# EAGLE design PDMschemE-Car2018 (EAGLE 8.4.1)
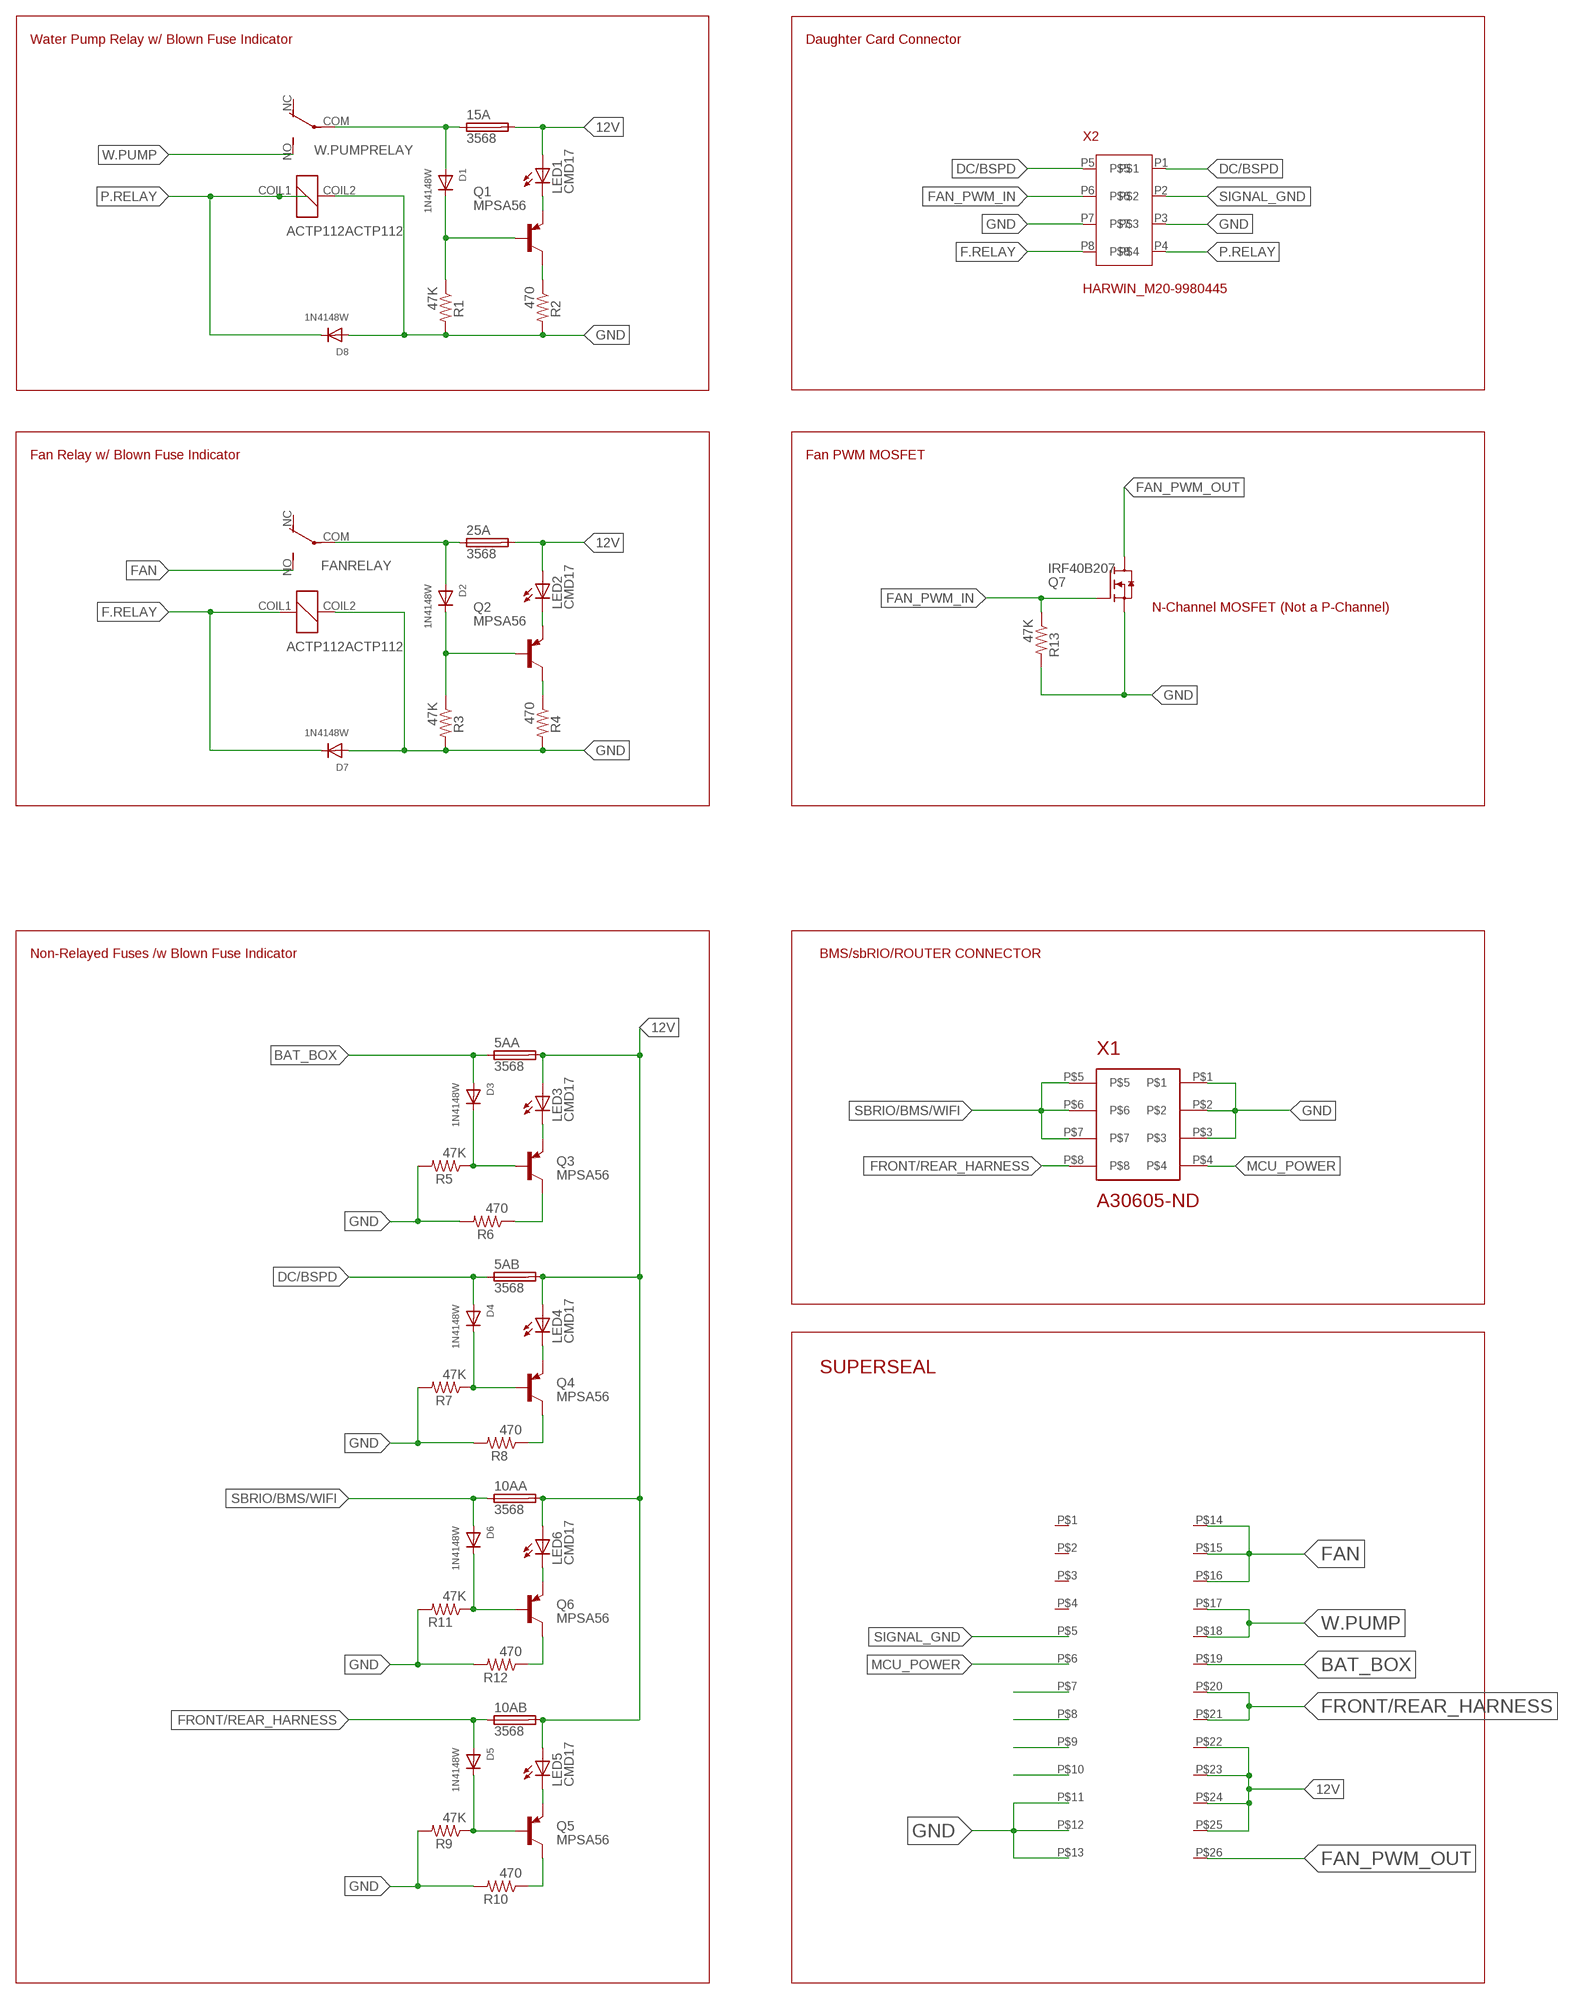
[diagram p0: schematic, sheet 1]

## Parts
5AA  3568  [3568]
5AB  3568  [3568]
10AA  3568  [3568]
10AB  3568  [3568]
15A  3568  [3568]
25A  3568  [3568]
D1  1N4148W  DIODESOD-123  [SOD-123]
D2  1N4148W  DIODESOD-123  [SOD-123]
D3  1N4148W  DIODESOD-123  [SOD-123]
D4  1N4148W  DIODESOD-123  [SOD-123]
D5  1N4148W  DIODESOD-123  [SOD-123]
D6  1N4148W  DIODESOD-123  [SOD-123]
D7  1N4148W  DIODESOD-123  [SOD-123]
D8  1N4148W  DIODESOD-123  [SOD-123]
FANRELAY  ACTP112ACTP112  [ACTP112]
LED1  CMD17  LEDCHIPLED_0805  [CHIPLED_0805]
LED2  CMD17  LEDCHIPLED_0805  [CHIPLED_0805]
LED3  CMD17  LEDCHIPLED_0805  [CHIPLED_0805]
LED4  CMD17  LEDCHIPLED_0805  [CHIPLED_0805]
LED5  CMD17  LEDCHIPLED_0805  [CHIPLED_0805]
LED6  CMD17  LEDCHIPLED_0805  [CHIPLED_0805]
Q1  MPSA56  [TO92-CBE]
Q2  MPSA56  [TO92-CBE]
Q3  MPSA56  [TO92-CBE]
Q4  MPSA56  [TO92-CBE]
Q5  MPSA56  [TO92-CBE]
Q6  MPSA56  [TO92-CBE]
Q7  IRF40B207  [TO220-3]
R1  47K  R-US_R1206  [R1206]
R2  470  R-US_R1206  [R1206]
R3  47K  R-US_R1206  [R1206]
R4  470  R-US_R1206  [R1206]
R5  47K  R-US_R1206  [R1206]
R6  470  R-US_R1206  [R1206]
R7  47K  R-US_R1206  [R1206]
R8  470  R-US_R1206  [R1206]
R9  47K  R-US_R1206  [R1206]
R10  470  R-US_R1206  [R1206]
R11  47K  R-US_R1206  [R1206]
R12  470  R-US_R1206  [R1206]
R13  47K  R-US_R1206  [R1206]
U$4  SUPERSEAL1.0_26POS_2ROW  [SUPERSEAL1.0_26POS_2ROW]
W.PUMPRELAY  ACTP112ACTP112  [ACTP112]
X1  A30605-ND  [A30605-ND]
X2  HARWIN_M20-9980445  [HARWIN_M20-9980445]

## Nets
12V: 5AA.3 5AA.4 5AB.3 5AB.4 10AA.3 10AA.4 10AB.3 10AB.4 15A.3 15A.4 25A.3 25A.4 LED1.A LED2.A LED3.A LED4.A LED5.A LED6.A U$4.P$22(B22) U$4.P$23(B23) U$4.P$24(B24) U$4.P$25(B25)
BAT_BOX: 5AA.1 5AA.2 D3.A U$4.P$19(B19)
DC/BSPD: 5AB.1 5AB.2 D4.A X2.P1 X2.P5
F.RELAY: D7.C FANRELAY.COIL1 X2.P8
FAN: FANRELAY.NO U$4.P$14(B14) U$4.P$15(B15) U$4.P$16(B16)
FAN_PWM_IN: Q7.G R13.1 X2.P6
FAN_PWM_OUT: Q7.D U$4.P$26(B26)
FRONT/REAR_HARNESS: 10AB.1 10AB.2 D5.A U$4.P$20(B20) U$4.P$21(B21) X1.P$8
GND: D7.A D8.A FANRELAY.COIL2 Q7.S R1.2 R2.2 R3.2 R4.2 R5.2 R6.2 R7.2 R8.2 R9.2 R10.2 R11.2 R12.2 R13.2 U$4.P$11(B11) U$4.P$12(B12) U$4.P$13(B13) W.PUMPRELAY.COIL2 X1.P$1 X1.P$2 X1.P$3 X2.P3 X2.P7
MCU_POWER: U$4.P$6(B6) X1.P$4
N$1: LED1.C Q1.E
N$2: Q3.C R6.1
N$3: LED3.C Q3.E
N$4: 25A.1 25A.2 D2.A FANRELAY.COM
N$5: Q1.C R2.1
N$6: D1.C Q1.B R1.1
N$9: D2.C Q2.B R3.1
N$10: 15A.1 15A.2 D1.A W.PUMPRELAY.COM
N$11: Q2.C R4.1
N$13: LED2.C Q2.E
N$14: D3.C Q3.B R5.1
N$17: LED4.C Q4.E
N$18: D4.C Q4.B R7.1
N$19: Q4.C R8.1
N$22: LED6.C Q6.E
N$23: D6.C Q6.B R11.1
N$24: Q6.C R12.1
N$25: U$4.P$7(B7)
N$26: U$4.P$8(B8)
N$27: LED5.C Q5.E
N$28: D5.C Q5.B R9.1
N$29: Q5.C R10.1
N$30: U$4.P$9(B9)
N$31: U$4.P$10(B10)
P.RELAY: D8.C W.PUMPRELAY.COIL1 X2.P4
SBRIO/BMS/WIFI: 10AA.1 10AA.2 D6.A X1.P$5 X1.P$6 X1.P$7
SIGNAL_GND: U$4.P$5(B5) X2.P2
W.PUMP: U$4.P$17(B17) U$4.P$18(B18) W.PUMPRELAY.NO
Unconnected: FANRELAY.NC U$4.P$1(B1) U$4.P$2(B2) U$4.P$3(B3) U$4.P$4(B4) W.PUMPRELAY.NC

## Notes on the sheet
- Water Pump Relay w/ Blown Fuse Indicator | Daughter Card Connector
- Fan Relay w/ Blown Fuse Indicator | Fan PWM MOSFET
- N-Channel MOSFET (Not a P-Channel)
- Non-Relayed Fuses /w Blown Fuse Indicator | BMS/sbRIO/ROUTER CONNECTOR
- SUPERSEAL

## Library data of the parts
5AA 5AB 10AA 10AB 15A 25A = Keystone:3568: Mini ATC Fuse Holder 20A 500V 1 Circuit Blade PCB
D1-D8 = adafruit:DIODE: Diode SMADIODE - SMA Surface Mount Package 20V 1A Schottky Diode Digikey: 641-1014-6-ND DO-1N4148 - Through Hole Small Current Diode SOD-123 20V 1 A (.5mV Vf) Schottky Diode - Digikey: MBRX120TPMSCT-ND SOD-323 10V 570mA (.38mV Vf, 3ns) Schottky Diode - Digikey: ZLLS410CT-ND SOD-523 30V 30mA Schottky Diode (RB751S-40TE61) - Digikey: RB751S-40TE61CT-ND SOT23-R/W - SOT23 Package (R = Solder Paste/Reflow Ovens, W = Hand-Soldering) BAT54Film 40V 300mA - Digikey: 497-7162-1-ND
FANRELAY W.PUMPRELAY = panasonic:ACTP112: ACTP112 Through-Hole Micro Relay
LED1-LED6 = adafruit:LED: LED OSRAM: - CHIPLED LG R971, LG N971, LY N971, LG Q971, LY Q971, LO R971, LY R971 LH N974, LH R974 LS Q976, LO Q976, LY Q976 LO Q996 - Hyper CHIPLED LW Q18S LB Q993, LB Q99A, LB R99A - SideLED LS A670, LO A670, LY A670, LG A670, LP A670 LB A673, LV A673, LT A673, LW A673 LH A674 LY A675 LS A676, LA A676, LO A676, LY A676, LW A676 LS A679, LY A679, LG A679 - Hyper Micro SIDELED® LS Y876, LA Y876, LO Y876, LY Y876 LT Y87S - SmartLED LW L88C, LW L88S LB L89C, LB L89S, LG L890 LS L89K, LO L89K, LY L89K LS L896, LA L896, LO L896, LY L896 - TOPLED LS T670, LO T670, LY T670, LG T670, LP T670 LSG T670, LSP T670, LSY T670, LOP T670, LYG T670 LG T671, LOG T671, LSG T671 LB T673, LV T673, LT T673, LW T673 LH T674 LS T676, LA T676, LO T676, LY T676, LB T676, LH T676, LSB T676, LW T676 LB T67C, LV T67C, LT T67C, LS T67K, LO T67K, LY T67K, LW E67C LS E67B, LA E67B, LO E67B, LY E67B, LB E67C, LV E67C, LT E67C LW T67C LS T679, LY T679, LG T679 LS T770, LO T770, LY T770, LG T770, LP T770 LB T773, LV T773, LT T773, LW T773 LH T774 LS E675, LA E675, LY E675, LS T675 LS T776, LA T776, LO T776, LY T776, LB T776 LHGB T686 LT T68C, LB T68C - Hyper Mini TOPLED® LB M676 - Mini TOPLED Santana® LG M470 LS M47K, LO M47K, LY M47K Source: http://www.osram.convergy.de/
Q1-Q6 = transistor-pnp:MPSA56*: PNP Transistror Source: http://www.fairchildsemi.com/ds/MM/MMBTA56.pdf
Q7 = infineon:IRF40B207: N Channel Power Mosfet
R1-R13 = resistor:R-US_: RESISTOR, American symbol
U$4 = TE:SUPERSEAL1.0_26POS_2ROW
X1 = formula electric:A30605-ND
X2 = formula electric:HARWIN_M20-9980445

## Board
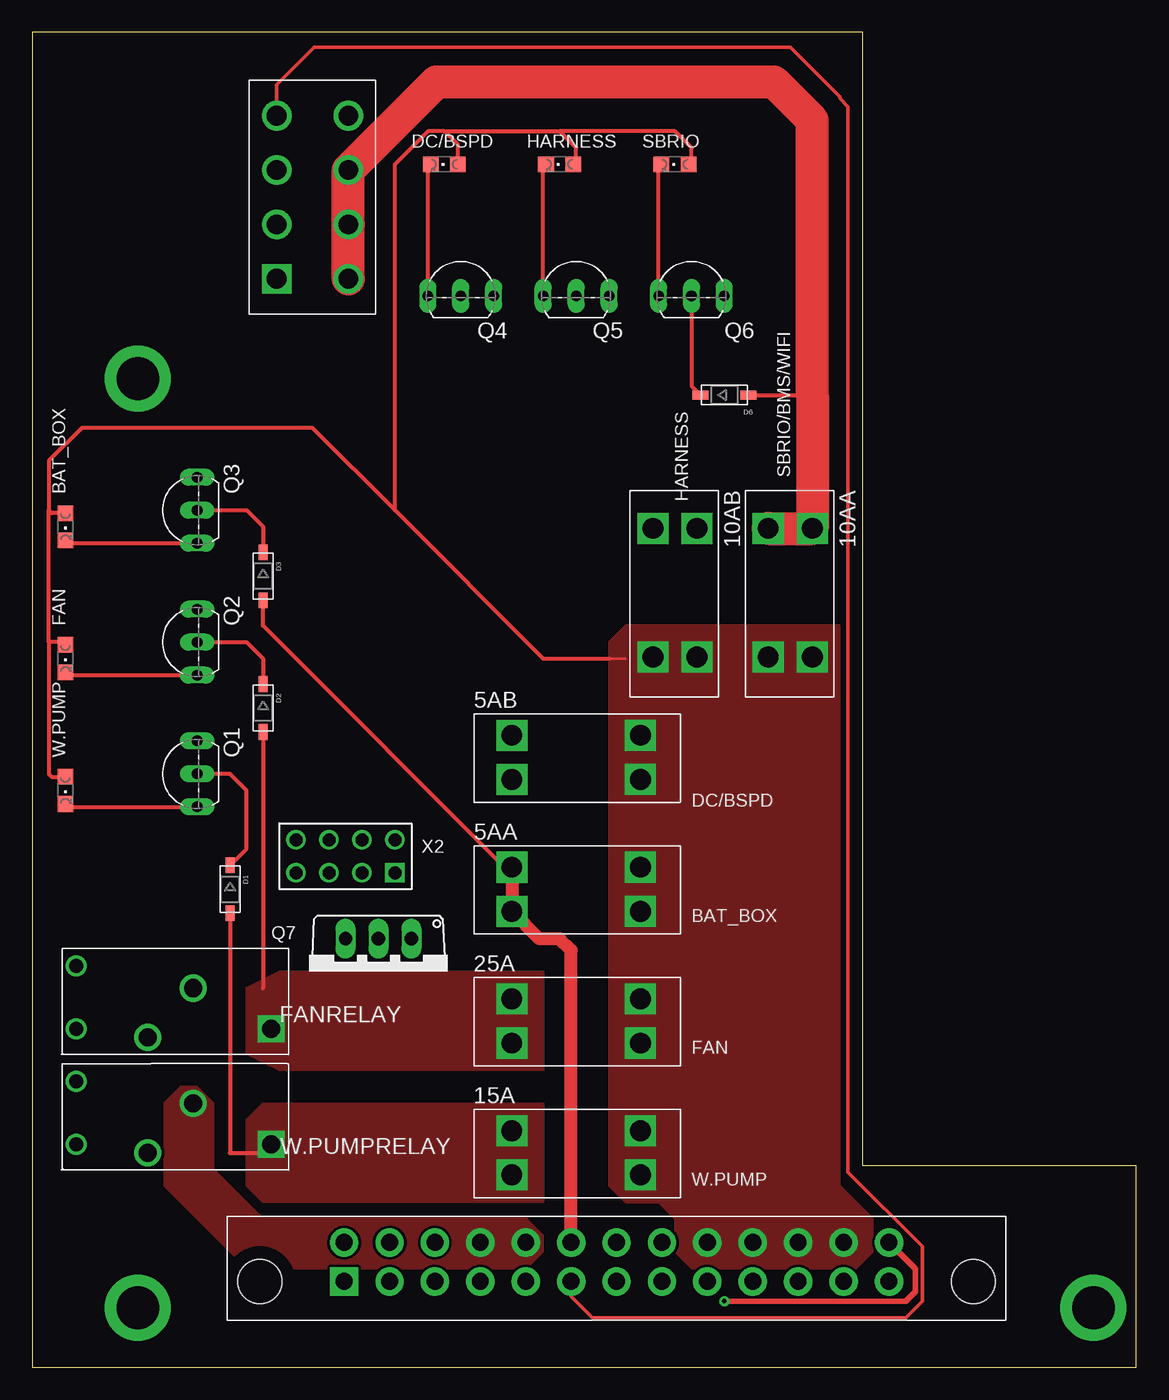
[diagram p1: board, top side]
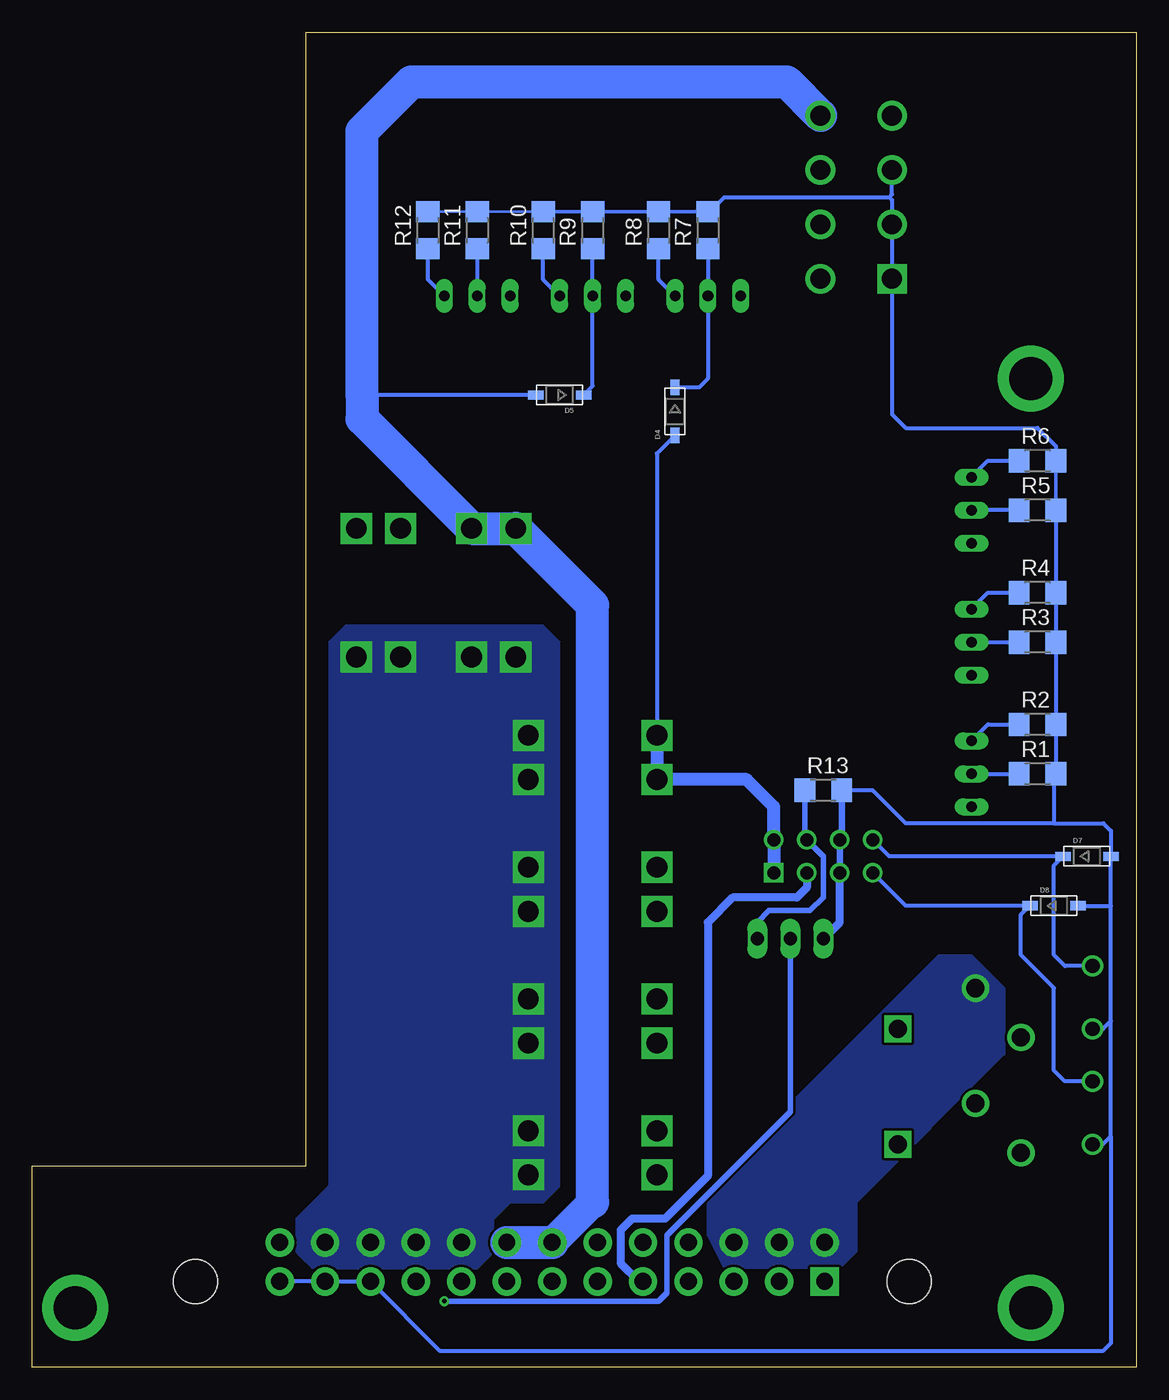
[diagram p2: board, bottom side, seen from below]

Size 85.09 x 102.87 mm. Coordinates in mm from the lower left corner, seen from the top.
Outline: 0,0 85.09,0 85.09,15.49 64.01,15.49 64.01,102.87 0,102.87 0,0
Copper layers (1*16): Top 0.035mm / dielectric 1.5mm / Bottom 0.035mm
Design rules "default *": minimum track width 6mil, minimum drill 0.35mm, track to track 8mil, track to pad 8mil, pad to pad 8mil, via to via 8mil, smd to smd 8mil, copper to edge 40mil, drill to drill 6mil, minimum pad ring 10mil, minimum via ring 8mil, stop-mask expansion 4mil, vias tented up to drill 0mil, thermal gap 10mil

### Footprints (pad centres in the part's own frame; a part is rotated, then mirrored left to right if it is on the bottom)
3568 = drill 1.6 square: 1 -4.953,1.702; 2 -4.953,-1.702; 3 4.953,1.702; 4 4.953,-1.702
SOD-123 = smd 1.2 x 0.7: A 1.85,0; C -1.85,0
ACTP112 = drill 1.092: COIL1 5.512,-5.512; COIL2 5.512,-0.66 | drill 1.397 square: COM -9.5,-0.66 | drill 1.397: NC 0,0; NO -3.505,-3.81
CHIPLED_0805 = smd 1.2 x 1.2: A 0,-1.05; C 0,1.05
TO92-CBE = drill 0.813 long: B 0,0; C 2.54,0; E -2.54,0
TO220-3 = drill 1.016 long: D 0,0; G -2.54,0; S 2.54,0
R1206 = smd 1.6 x 1.803: 1 -1.422,0; 2 1.422,0
SUPERSEAL1.0_26POS_2ROW = drill 1.3 pad 2.184 square: P$1 6.5,0 | drill 1.3 pad 2.184: P$2 10,0; P$3 13.5,0; P$4 17,0; P$5 20.5,0; P$6 24,0; P$7 27.5,0; P$8 31,0; P$9 34.5,0; P$10 38,0; P$11 41.5,0; P$12 45,0; P$13 48.5,0; P$14 6.5,3; P$15 10,3; P$16 13.5,3; P$17 17,3; P$18 20.5,3; P$19 24,3; P$20 27.5,3; P$21 31,3; P$22 34.5,3; P$23 38,3; P$24 41.5,3; P$25 45,3; P$26 48.5,3 | hole 3.4: 0,0; 55,0
A30605-ND = drill 1.524 square: P$1 -6.287,2.756 | drill 1.524: P$2 -2.095,2.756; P$3 2.095,2.756; P$4 6.287,2.756; P$5 -6.287,-2.756; P$6 -2.095,-2.756; P$7 2.095,-2.756; P$8 6.287,-2.756
HARWIN_M20-9980445 = drill 1 square: P1 -3.81,1.27 | drill 1: P2 -1.27,1.27; P3 1.27,1.27; P4 3.81,1.27; P5 -3.81,-1.27; P6 -1.27,-1.27; P7 1.27,-1.27; P8 3.81,-1.27

### Placement (x,y rotation side)
5AA  41.91,36.83 0 top
5AB  41.91,46.99 0 top
10AA  58.42,59.69 270 top
10AB  49.53,59.69 270 top
15A  41.91,16.51 0 top
25A  41.91,26.67 0 top
D1  15.24,36.83 270 top
D2  17.78,50.8 270 top
D3  17.78,60.96 270 top
D4  35.56,73.66 270 bottom
D5  44.45,74.93 180 bottom
D6  53.34,74.93 0 top
D7  3.81,39.37 0 bottom
D8  6.35,35.56 0 bottom
FANRELAY  8.89,25.4 180 top
LED1  2.54,44.45 180 top
LED2  2.54,54.61 180 top
LED3  2.54,64.77 180 top
LED4  31.75,92.71 90 top
LED5  40.64,92.71 90 top
LED6  49.53,92.71 90 top
Q1  12.7,45.72 90 top
Q2  12.7,55.88 90 top
Q3  12.7,66.04 90 top
Q4  33.02,82.55 0 top
Q5  41.91,82.55 0 top
Q6  50.8,82.55 0 top
Q7  26.67,33.02 180 top
R1  7.62,45.72 0 bottom
R2  7.62,49.53 0 bottom
R3  7.62,55.88 0 bottom
R4  7.62,59.69 0 bottom
R5  7.62,66.04 0 bottom
R6  7.62,69.85 0 bottom
R7  33.02,87.63 90 bottom
R8  36.83,87.63 90 bottom
R9  41.91,87.63 90 bottom
R10  45.72,87.63 90 bottom
R11  50.8,87.63 90 bottom
R12  54.61,87.63 90 bottom
R13  24.13,44.45 0 bottom
U$4  17.53,6.6 0 top
W.PUMPRELAY  8.89,16.51 180 top
X1  21.59,90.17 90 top
X2  24.13,39.37 180 top

### Tracks (layer width: path | path; a pad name or v marks a point on that pad's centre or on a via)
12V
  Top 0.152: 2.54,66.04 LED3.A | 32.91,92.82 LED4.A | 41.8,92.82 LED5.A | 50.69,92.82 LED6.A | 44.45,54.61 45.72,54.61
  Top 0.203: 2.32,55.88 LED2.A | 33.02,92.93 32.91,92.82 | 41.91,92.93 41.8,92.82 | 50.8,92.93 50.69,92.82
  Top 0.305: 27.94,66.04 39.37,54.61 44.45,54.61 | 27.94,66.04 27.94,92.71 30.48,95.25 31.75,95.25 | 31.75,95.25 40.64,95.25 | LED4.A 32.8,94.2 31.75,95.25 | LED5.A 41.91,92.93 41.91,93.98 40.64,95.25 | 40.64,95.25 49.53,95.25 50.8,93.98 50.8,92.93 LED6.A | 27.94,66.04 21.59,72.39 3.81,72.39 1.27,69.85 1.27,66.04 | LED3.A 1.49,65.82 1.27,66.04 | LED1.A 1.49,45.5 1.27,45.72 1.27,55.88 | 1.27,55.88 1.27,66.04 | LED2.A 2.32,55.88 1.27,55.88
  pour Top (no thermals): 62.23,57.15 45.72,57.15 44.45,55.88 44.45,13.97 45.72,12.7 48.26,12.7 49.53,11.43 49.53,8.89 50.8,7.62 63.5,7.62 64.77,8.89 64.77,11.43 62.23,13.97
  pour Bottom (no thermals): 45.72,57.15 60.96,57.15 62.23,55.88 62.23,13.97 64.77,11.43 64.77,8.89 63.5,7.62 50.8,7.62 49.53,8.89 49.53,11.43 48.26,12.7 45.72,12.7 44.45,13.97 44.45,55.88
BAT_BOX
  Top 0.203: 36.4,38.53 5AA.1
  Top 0.305: 36.96,38.1 36.83,38.1 17.78,57.15 D3.A
  Top 1.016: 5AA.1 36.96,38.1 5AA.2 39.06,33.02 40.64,33.02 41.53,32.13 U$4.P$19
DC/BSPD
  Bottom 0.305: D4.A 36.96,70.41 5AB.1
  Bottom 1.016: X2.P1 X2.P5 27.94,43.18 30.05,45.29 5AB.2 5AB.1
F.RELAY
  Bottom 0.305: X2.P8 19.05,39.37 D7.C 6.35,38.68 6.35,31.75 5.51,30.91 FANRELAY.COIL1
FAN
  pour Bottom (no thermals): 33.02,10.16 33.02,13.97 15.24,31.75 12.7,31.75 10.16,29.21 10.16,24.13 21.59,12.7 21.59,8.89 22.86,7.62 31.75,7.62
FAN_PWM_IN
  Bottom 0.305: X2.P6 25.55,40.79
  Bottom 0.406: R13.1 25.55,40.79 | X2.P6 24.13,39.37 24.13,36.2 25.15,35.18 28.32,35.18 29.21,34.29 Q7.G
FAN_PWM_OUT  (via drill 0.35)
  Top 0.406: v53.34,5.08 67.31,5.08 68.05,5.82 68.05,7.58 U$4.P$26
  Bottom 0.406: Q7.D 26.67,21.59 26.67,20.7 26.67,19.68 36.2,10.16 36.2,5.71 36.83,5.08 v53.34,5.08
FRONT/REAR_HARNESS
  Bottom 0.305: D5.A 59.69,74.93
  Bottom 2.286: 45.01,9.6 41.91,12.7
  Bottom 2.54: X1.P$8 26.95,99.06 55.88,99.06 59.69,95.25 59.69,74.93 59.69,73.1 10AB.1 10AB.2 41.91,58.73 41.91,12.7 | U$4.P$21 U$4.P$20 45.01,9.6
GND
  Bottom 0.203: R12.2 R11.2 R10.2
  Bottom 0.254: R6.2 R5.2 | R10.2 R9.2 R8.2 R7.2
  Bottom 0.305: R7.2 32.87,89.05 31.75,90.17 19.05,90.17 | 19.05,90.17 18.83,90.39 X1.P$3 | 19.05,90.17 18.83,89.95 X1.P$2 X1.P$1 18.83,73.44 17.78,72.39 7.62,72.39 6.2,70.97 R6.2 | R5.2 R4.2 R3.2 R2.2 R1.2 6.35,45.57 6.35,41.91 | 6.35,41.91 2.54,41.91 1.96,41.33 D7.A 1.96,35.56 | 6.35,41.91 17.78,41.91 20.32,44.45 R13.2 | 1.96,26.67 1.96,35.56 | 1.96,17.78 1.96,26.67 | 1.96,17.78 1.96,1.85 2.54,1.27 53.69,1.27 U$4.P$11 U$4.P$12 U$4.P$13 | D8.A 1.96,35.56 | FANRELAY.COIL2 2.57,26.06 1.96,26.67 | W.PUMPRELAY.COIL2 2.57,17.17 1.96,17.78
  Bottom 0.508: R13.2 22.71,40.79 X2.P7 X2.P3
  Bottom 0.61: Q7.S 22.86,34.29 X2.P3
MCU_POWER
  Top 0.254: X1.P$4 18.83,98.84 21.72,101.73 58.42,101.73 62.23,97.92 62.23,97.79 62.86,97.16 62.86,15.02 68.58,9.3 68.58,5.08 67.31,3.81 43.18,3.81 41.53,5.46 U$4.P$6
N$1
  Top 0.305: Q1.E 2.54,43.18 LED1.C
N$2
  Bottom 0.305: Q3.C 11.43,69.85 R6.1
N$3
  Top 0.305: LED3.C 2.76,63.5 Q3.E
N$4
  Top 0.305: D2.A 17.78,29.21
  pour Top (no thermals): 39.37,30.48 39.37,22.86 19.05,22.86 16.51,24.13 16.51,29.21 19.05,30.48
N$5
  Bottom 0.305: Q1.C 11.43,49.53 R2.1
N$6
  Top 0.305: D1.C 16.51,39.95 16.51,44.45 15.24,45.72 Q1.B
  Bottom 0.305: Q1.B R1.1
N$7  (via drill 3.3 pad 5.08)
  other vias: 8.13,4.57
N$8  (via drill 3.3 pad 5.08)
  other vias: 81.79,4.57
N$9
  Top 0.305: Q2.B 16.51,55.88 17.78,54.61 D2.C
  Bottom 0.305: Q2.B R3.1
N$10
  Top 0.305: D1.A 15.24,16.51 17.78,16.51 18.39,17.12 W.PUMPRELAY.COM
  pour Top (no thermals): 17.78,20.32 39.37,20.32 39.37,12.7 17.78,12.7 16.51,13.97 16.51,19.05
N$11
  Bottom 0.305: Q2.C 11.43,59.69 R4.1
N$12  (via drill 3.3 pad 5.08)
  other vias: 8.13,76.2
N$13
  Top 0.305: Q2.E 2.54,53.34 LED2.C
N$14
  Top 0.305: Q3.B 16.51,66.04 17.78,64.77 D3.C
  Bottom 0.305: R5.1 Q3.B
N$17
  Top 0.152: 30.7,81.5 Q4.E
  Top 0.305: Q4.E 30.48,92.49 LED4.C
N$18
  Bottom 0.305: R7.1 Q4.B 33.02,76.2 33.71,75.51 D4.C
N$19
  Bottom 0.305: Q4.C 36.83,83.82 R8.1
N$22
  Top 0.203: 48.48,81.5 Q6.E
  Top 0.305: Q6.E 48.26,92.49 LED6.C
N$23
  Top 0.305: Q6.B 50.8,75.62 D6.C
  Bottom 0.305: R11.1 Q6.B
N$24
  Bottom 0.305: Q6.C 54.61,83.82 R12.1
N$27
  Top 0.152: 39.37,92.49 39.48,92.6 LED5.C | 39.48,81.39 Q5.E
  Top 0.254: 39.59,81.5 Q5.E
  Top 0.305: Q5.E 39.37,92.49 39.48,92.6
N$28
  Bottom 0.305: R9.1 Q5.B 41.91,75.62 D5.C
N$29
  Bottom 0.305: Q5.C 45.72,83.82 R10.1
P.RELAY
  Bottom 0.305: X2.P4 17.78,35.56 D8.C 8.89,34.87 8.89,31.75 6.35,29.21 6.35,22.86 5.51,22.02 W.PUMPRELAY.COIL1
SBRIO/BMS/WIFI
  Top 0.152: 59.69,74.93 60.12,74.93
  Top 0.305: D6.A 59.69,74.93
  Top 2.54: 10AA.2 10AA.1 60.12,74.93 60.12,96.09 57.15,99.06 31.14,99.06 X1.P$7 | X1.P$5 X1.P$7 | X1.P$6 X1.P$7
SIGNAL_GND
  Bottom 0.61: X2.P2 25.4,36.96 26.16,36.2 31.11,36.2 33.02,34.29 33.02,14.73 36.32,11.43 38.86,11.43 39.75,10.54 39.75,8 38.35,6.6 U$4.P$5
W.PUMP
  pour Top (no thermals): 11.43,21.59 10.16,20.32 10.16,13.97 16.51,7.62 38.1,7.62 39.37,8.89 39.37,10.16 38.1,11.43 17.78,11.43 13.97,15.24 13.97,20.32 12.7,21.59

### Text on the board
tPlace: DC/BSPD | HARNESS | SBRIO | HARNESS | SBRIO/BMS/WIFI | BAT_BOX | FAN | W.PUMP | DC/BSPD | BAT_BOX | FAN | W.PUMP
205bmp: E-PDM 2018 / Designed by: Angel Delgado / Albert Panuco